# EAGLE design Pilot_Interface_005 (EAGLE 6.5.0)
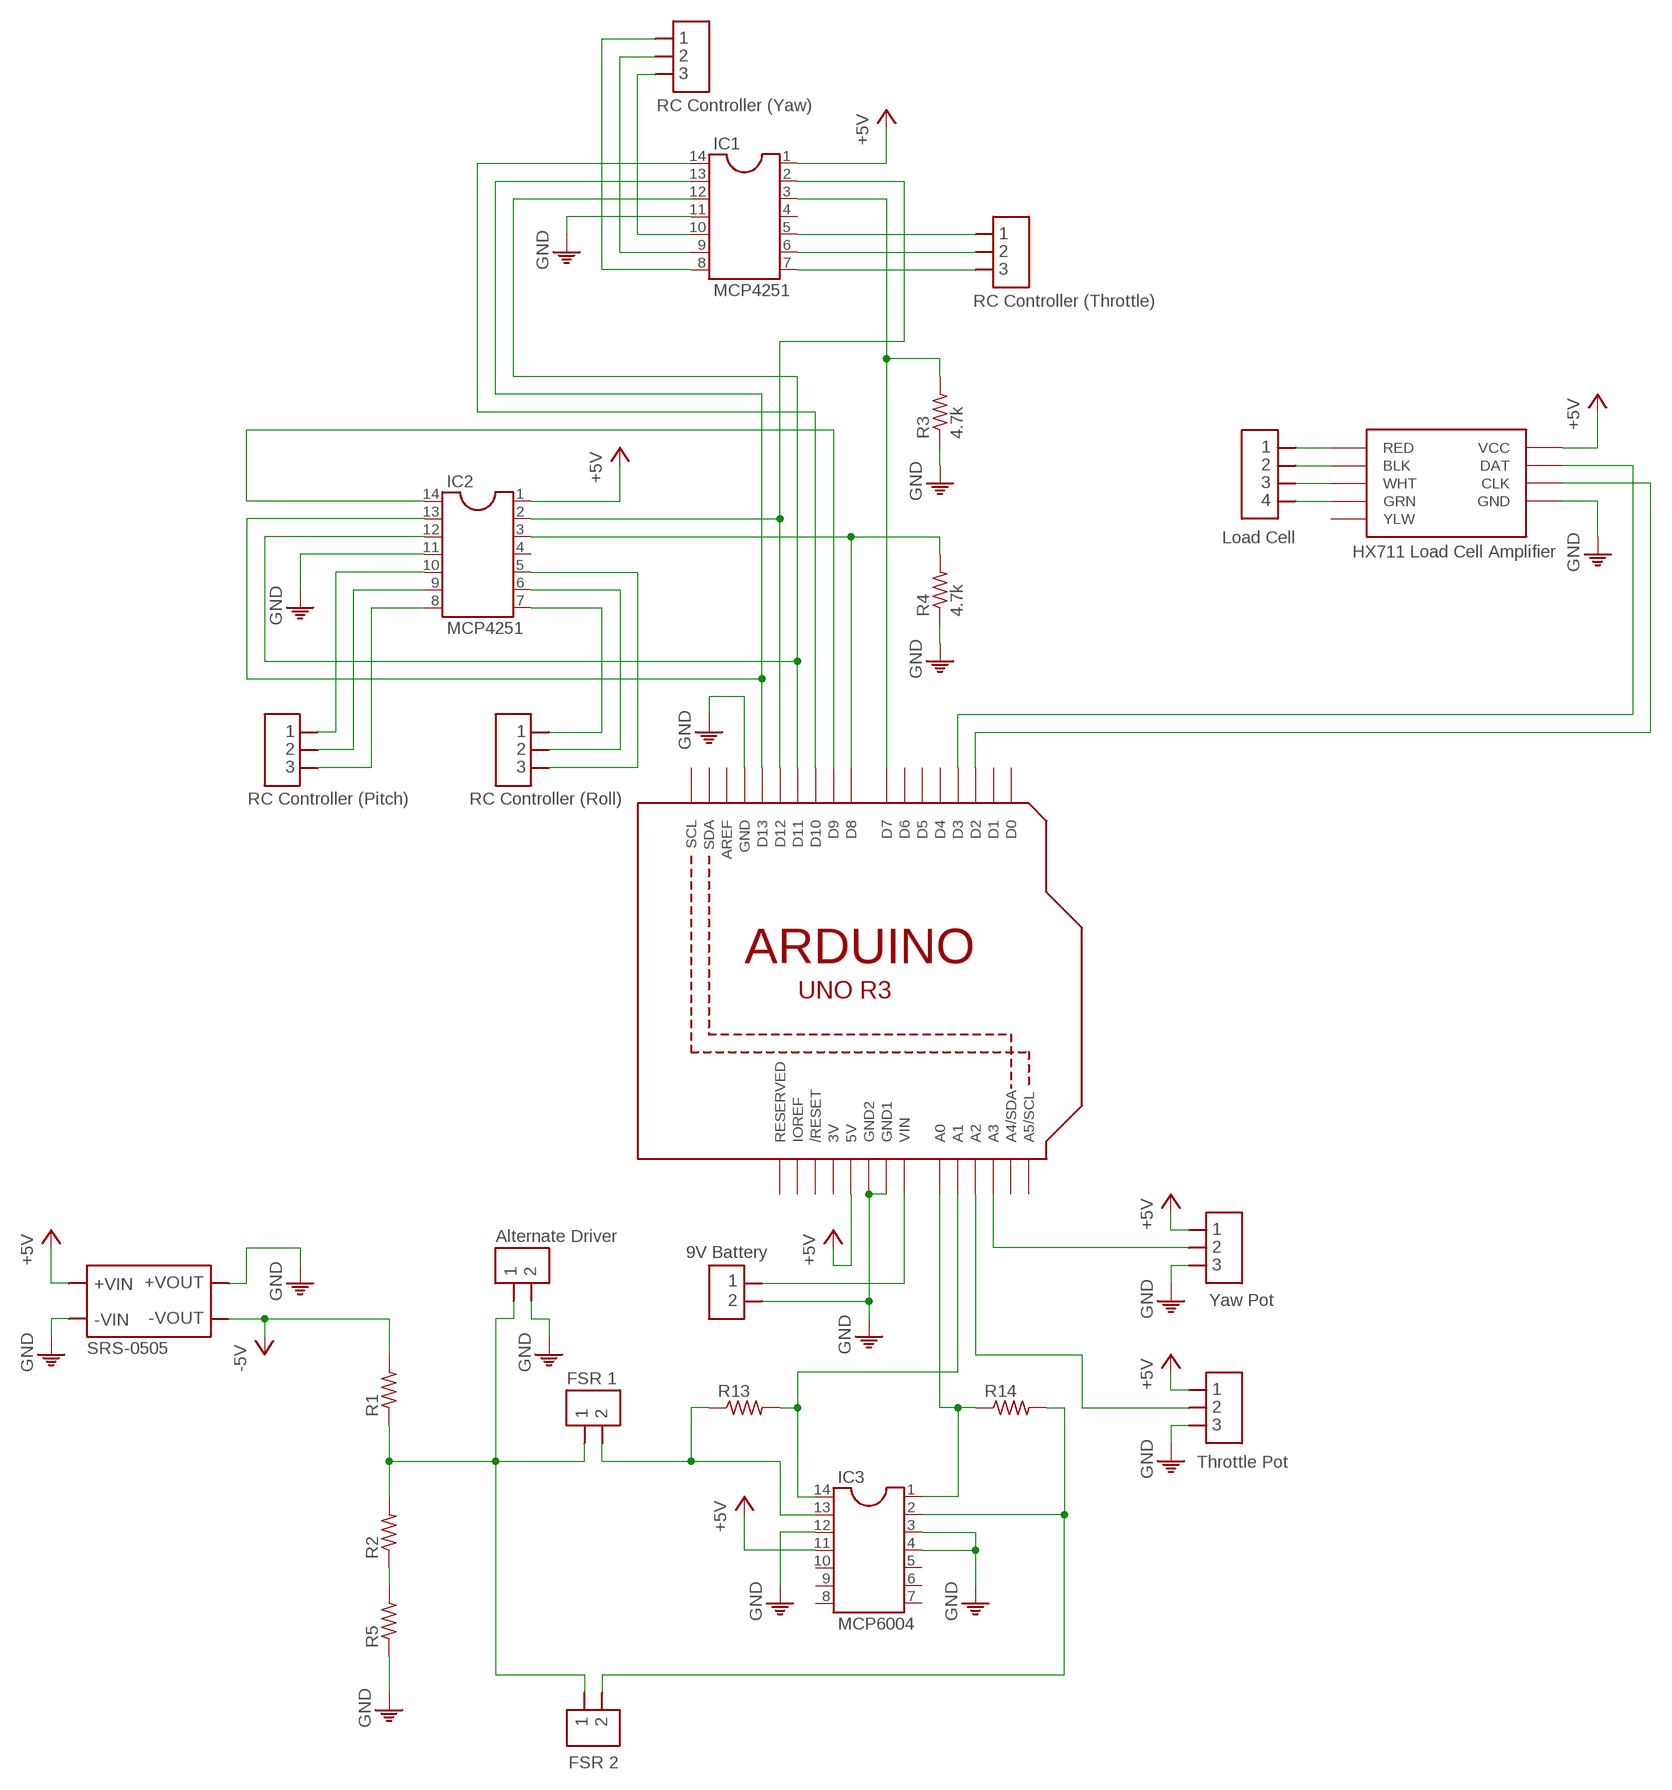
[diagram p0: schematic, sheet 1]

## Parts
IC1  MCP4251  DIL14  [DIL14]
IC2  MCP4251  DIL14  [DIL14]
IC3  MCP6004  DIL14  [DIL14]
R1  R-US_0204/2V  [0204V]
R2  R-US_0204/2V  [0204V]
R3  4.7k  R-US_0204/2V  [0204V]
R4  4.7k  R-US_0204/2V  [0204V]
R5  R-US_0204/2V  [0204V]
R13  R-US_0204/2V  [0204V]
R14  R-US_0204/2V  [0204V]
U1  ARDUINOR3  [ARDUINOR3]
U$1  HX711  [HX711]
U$2  PAD_3  [PAD_3]
U$3  PAD_3  [PAD_3]
U$4  PAD_2  [PAD_2]
U$5  PAD_2  [PAD_2]
U$6  PAD_3  [PAD_3]
U$7  PAD_3  [PAD_3]
U$8  PAD_4  [PAD_4]
U$9  SRS-0505  [SRS-0505]
U$10  PAD_3  [PAD_3]
U$11  PAD_3  [PAD_3]
U$12  PAD_2  [PAD_2]
U$13  PAD_2  [PAD_2]

## Nets
+5V: IC1.1 IC2.1 IC3.11 U1.5V U$1.VCC U$6.P$1 U$7.P$1 U$9.P$1(+VIN) U$9.P$16(+VIN)
-5V: R1.2 U$9.P$6(-VOUT) U$9.P$11(-VOUT)
N$1: U$1.RED U$8.P$1
N$2: U$1.BLK U$8.P$2
N$3: U$1.WHT U$8.P$3
N$4: U$1.GRN U$8.P$4
N$5: IC3.2 R14.2 U$5.P$2
N$6: U1.D2 U$1.CLK
N$7: U1.D3 U$1.DAT
N$8: IC3.14 R13.2 U1.A1
N$9: IC3.1 R14.1 U1.A0
N$10: U1.A3 U$6.P$2
N$11: U1.A2 U$7.P$2
N$12: R1.1 R2.2 U$4.P$1 U$5.P$1 U$12.P$1
N$13: IC2.14 U1.D9
N$14: IC1.14 U1.D10
N$15: IC1.13 IC2.13 U1.D13
N$16: IC1.12 IC2.12 U1.D11
N$17: IC1.2 IC2.2 U1.D12
N$18: IC1.3 R3.2 U1.D7
N$19: IC2.3 R4.2 U1.D8
N$20: IC1.5 U$3.P$1
N$21: IC1.6 U$3.P$2
N$22: IC1.7 U$3.P$3
N$23: IC1.10 U$2.P$3
N$24: IC1.9 U$2.P$2
N$25: IC1.8 U$2.P$1
N$26: IC2.8 U$10.P$3
N$27: IC2.9 U$10.P$2
N$28: IC2.10 U$10.P$1
N$29: IC2.7 U$11.P$1
N$30: IC2.6 U$11.P$2
N$31: IC2.5 U$11.P$3
N$32: IC3.13 R13.1 U$4.P$2
N$33: R2.1 R5.2
N$34: U1.VIN U$13.P$1
PE: IC1.11 IC2.11 IC3.3 IC3.4 IC3.12 R3.1 R4.1 R5.1 U1.GND U1.GND1 U1.GND2 U$1.GND U$6.P$3 U$7.P$3 U$9.P$7(+VOUT) U$9.P$8(-VIN) U$9.P$9(-VIN) U$9.P$10(+VOUT) U$12.P$2 U$13.P$2 ; supply symbol labelled GND
Unconnected: IC1.4 IC2.4 IC3.5 IC3.6 IC3.7 IC3.8 IC3.9 IC3.10 U1.A4(A4/SDA) U1.A5(A5/SCL) U1.AREF U1.D0 U1.D1 U1.D4 U1.D5 U1.D6 U1.IOREF U1.RESERVED U1.RESET(/RESET) U1.SCL U1.SDA U$1.YLW

## Notes on the sheet
- RC Controller (Yaw)
- RC Controller (Throttle)
- Load Cell
- RC Controller (Pitch) | RC Controller (Roll)
- Alternate Driver
- 9V Battery
- Yaw Pot
- FSR 1
- Throttle Pot
- FSR 2

## Power pins joined to a net without a drawn wire
3V: U1.3V

## Library data of the parts
IC1-IC3 = MTW:DIL14: Dual In Line / Socket
R1-R5 R13 R14 = adafruit:R-US_: RESISTOR, American symbol
U1 = MTW:ARDUINOR3: This is a new object for the new Arduino R3 - with extra pins that you may want to use (such as IOref, and duplicated A4/A5
U$1 = MTW:HX711
U$2 U$3 U$6 U$7 U$10 U$11 = MTW:PAD_3
U$4 U$5 U$12 U$13 = MTW:PAD_2
U$8 = MTW:PAD_4
U$9 = MTW:SRS-0505

## Board
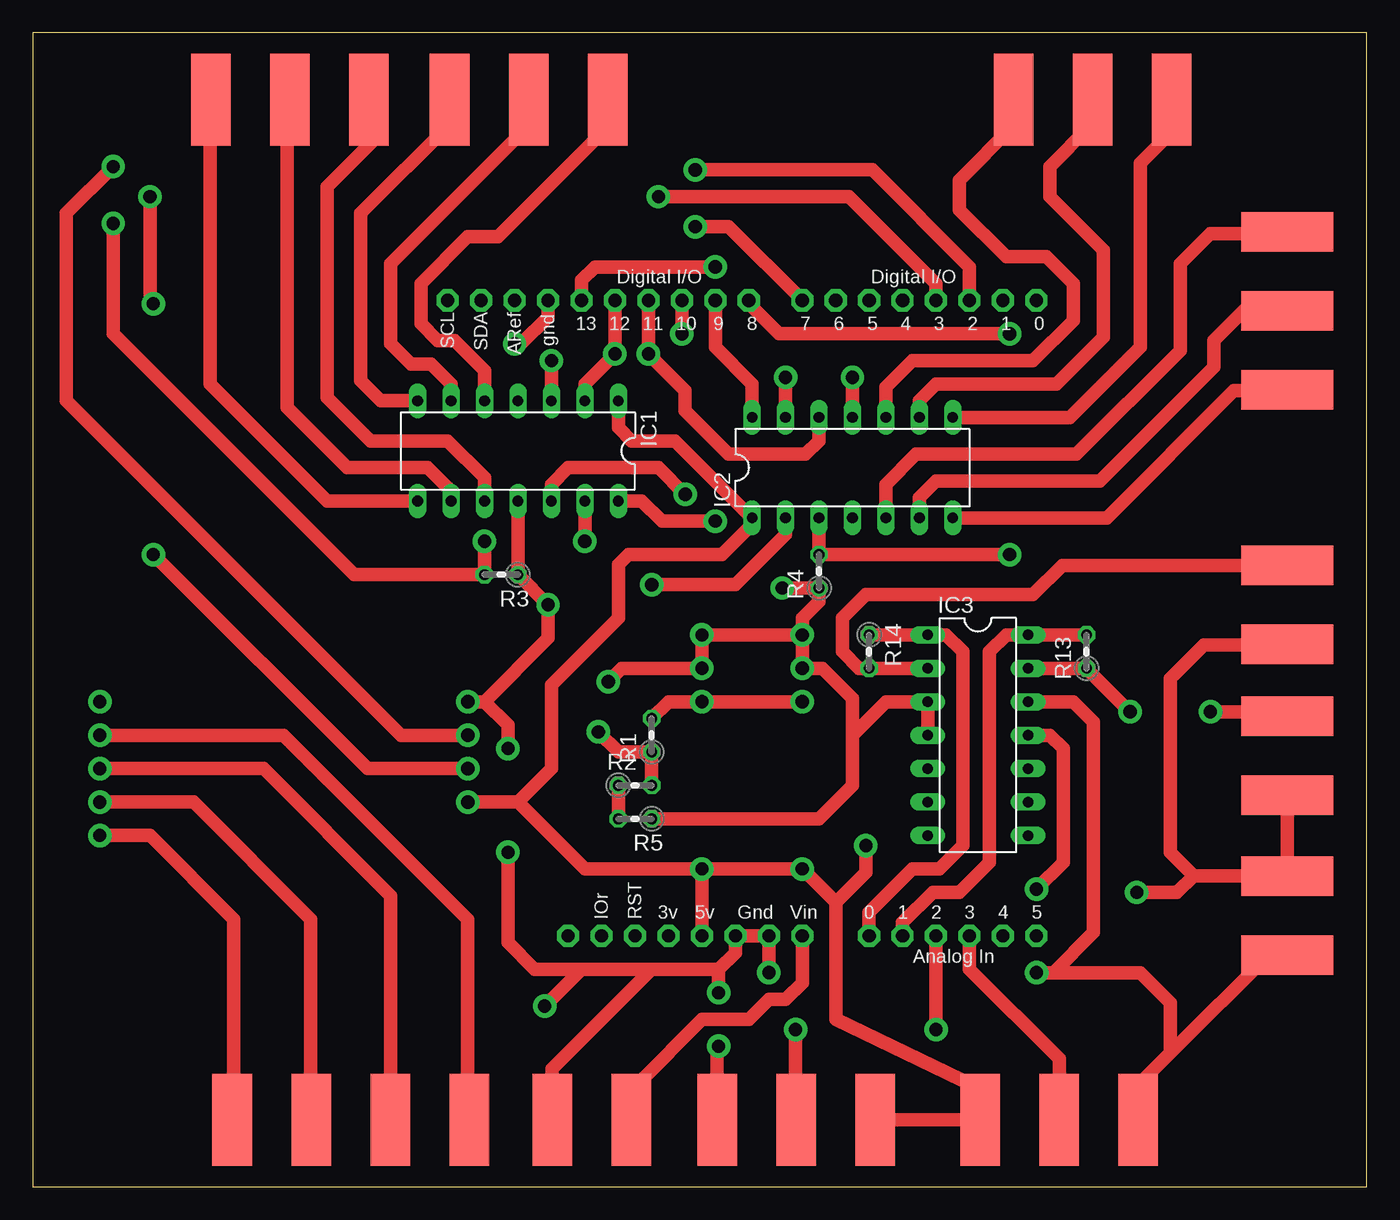
[diagram p1: board, top side]
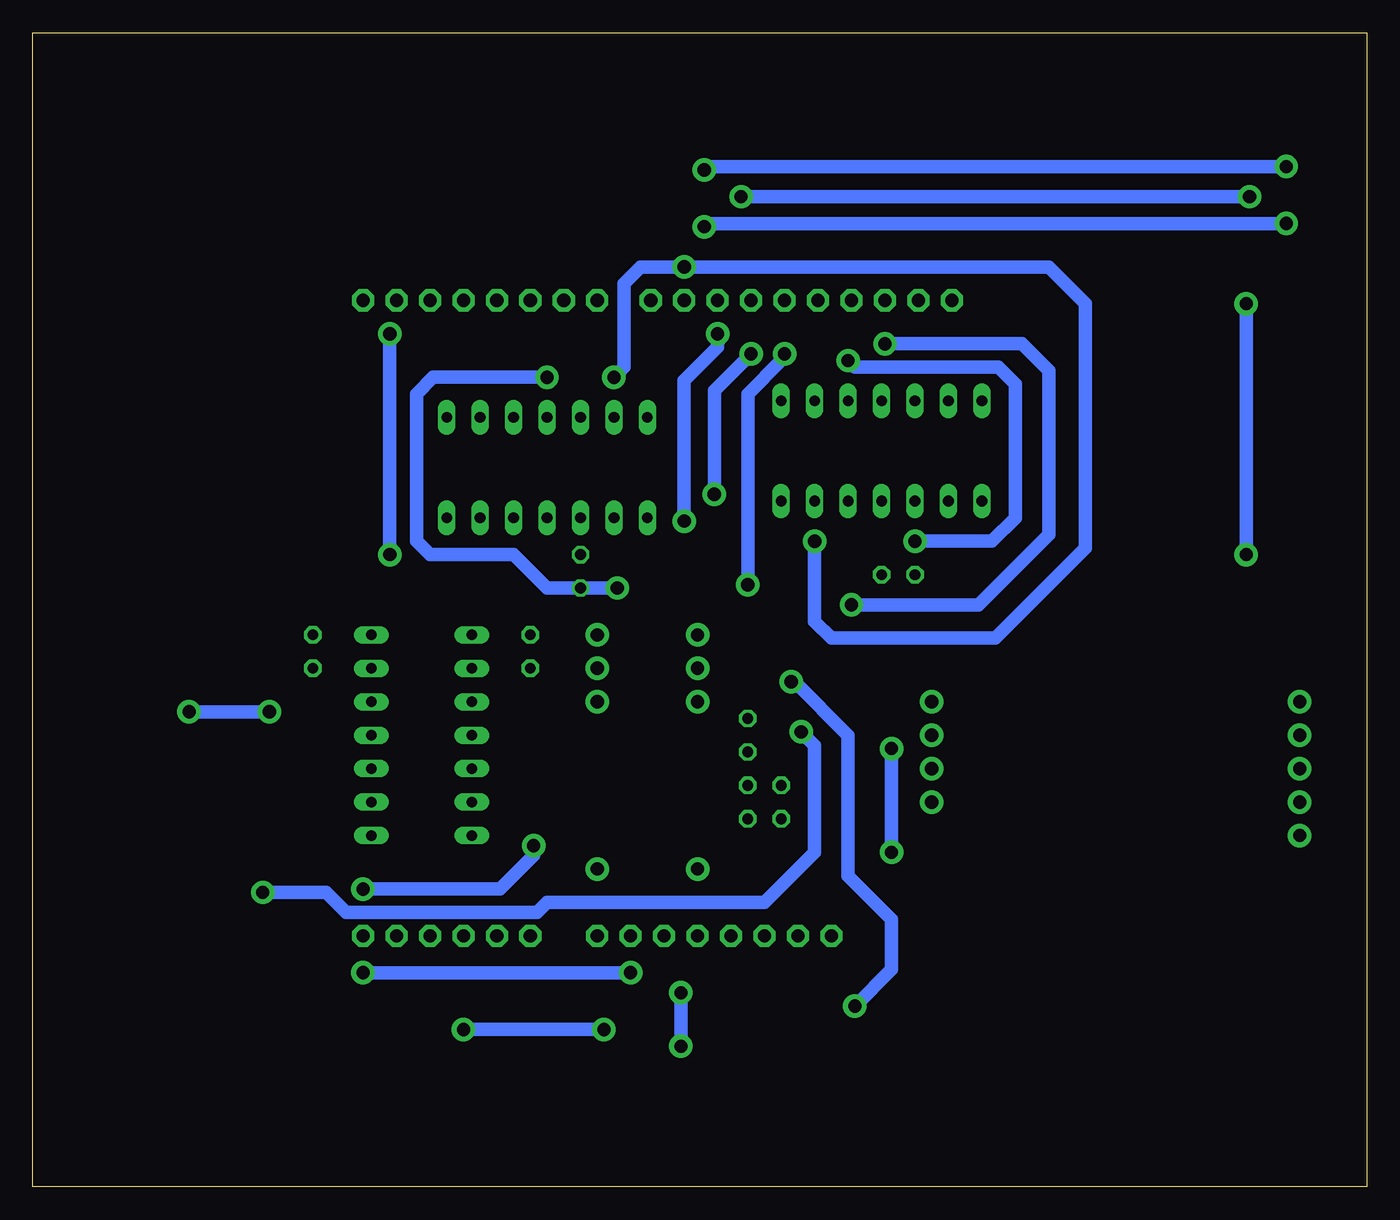
[diagram p2: board, bottom side, seen from below]

Size 101.27 x 87.62 mm. Coordinates in mm from the lower left corner, seen from the top.
Outline: 0,0 101.27,0 101.27,87.62 0,87.62 0,0
Copper layers (1*16): Top 0.035mm / dielectric 1.5mm / Bottom 0.035mm
Design rules "default": minimum track width 10mil, minimum drill 24mil, track to track 8mil, track to pad 8mil, pad to pad 8mil, via to via 8mil, smd to smd 8mil, copper to edge 40mil, drill to drill 8mil, minimum pad ring 10mil, minimum via ring 8mil, stop-mask expansion 4mil, vias tented up to drill 0mil, thermal gap 10mil

### Footprints (pad centres in the part's own frame; a part is rotated, then mirrored left to right if it is on the bottom)
DIL14 = drill 0.813 long: 1 -7.62,-3.81; 2 -5.08,-3.81; 3 -2.54,-3.81; 4 0,-3.81; 5 2.54,-3.81; 6 5.08,-3.81; 7 7.62,-3.81; 8 7.62,3.81; 9 5.08,3.81; 10 2.54,3.81; 11 0,3.81; 12 -2.54,3.81; 13 -5.08,3.81; 14 -7.62,3.81
0204V = drill 0.813 octagon: 1 -1.27,0; 2 1.27,0
ARDUINOR3 = drill 1 pad 1.676 octagon: 3V 35.56,2.54; 5V 38.1,2.54; A0 50.8,2.54; A1 53.34,2.54; A2 55.88,2.54; A3 58.42,2.54; A4 60.96,2.54; A5 63.5,2.54; AREF 23.876,50.8; D0 63.5,50.8; D1 60.96,50.8; D2 58.42,50.8; D3 55.88,50.8; D4 53.34,50.8; D5 50.8,50.8; D6 48.26,50.8; D7 45.72,50.8; D8 41.656,50.8; D9 39.116,50.8; D10 36.576,50.8; D11 34.036,50.8; D12 31.496,50.8; D13 28.956,50.8; GND 26.416,50.8; GND1 43.18,2.54; GND2 40.64,2.54; IOREF 30.48,2.54; RESERVED 27.94,2.54; RESET 33.02,2.54; SCL 18.796,50.8; SDA 21.336,50.8; VIN 45.72,2.54
HX711 = drill 1 pad 1.778: BLK 13.97,2.54; CLK -13.97,-2.54; DAT -13.97,0; GND -13.97,-5.08; GRN 13.97,-2.54; RED 13.97,5.08; VCC -13.97,2.54; WHT 13.97,0; YLW 13.97,-5.08
PAD_3 = smd 3 x 7: P$1 -3,0; P$2 3,0; P$3 9,0
PAD_2 = smd 3 x 7: P$1 -2,0; P$2 4,0
PAD_4 = smd 3 x 7: P$1 -9,0; P$2 -3,0; P$3 3,0; P$4 9,0
SRS-0505 = drill 1 pad 1.778: P$1 3.81,7.62; P$6 3.81,-5.08; P$7 3.81,-7.62; P$8 3.81,-10.16; P$9 -3.81,-10.16; P$10 -3.81,-7.62; P$11 -3.81,-5.08; P$16 -3.81,7.62

### Placement (x,y rotation side)
IC1  36.83,55.88 180 top
IC2  62.23,54.61 0 top
IC3  71.75,34.29 270 top
R1  46.99,34.29 90 top
R2  45.72,30.48 0 top
R3  35.56,46.48 180 top
R4  59.69,46.74 90 top
R5  45.72,27.94 180 top
R13  80.01,40.64 90 top
R14  63.5,40.64 270 top
U1  12.7,16.51 0 top
U$1  19.05,31.75 180 top
U$2  16.51,82.55 0 top
U$3  40.64,82.55 180 top
U$4  95.25,31.75 90 top
U$5  95.25,43.18 90 top
U$6  74.93,5.08 0 top
U$7  60.96,5.08 180 top
U$8  24.13,5.08 0 top
U$9  54.61,31.75 180 top
U$10  77.47,82.55 0 top
U$11  95.25,63.5 90 top
U$12  95.25,21.59 270 top
U$13  43.43,5.08 180 top

### Tracks (layer width: path | path; a pad name or v marks a point on that pad's centre or on a via)
+5V  (via drill 1 pad 1.78)
  Top 1.016: U1.5V U$9.P$1 | U$9.P$1 U$9.P$16 60.96,21.59 | U$1.VCC 36.83,29.21 | 36.83,29.21 41.91,24.13 U$9.P$1 | 36.83,29.21 39.37,31.75 39.37,38.1 44.45,43.18 44.45,47.24 45.21,48.01 52.32,48.01 54.61,50.29 IC2.1 48.77,56.64 45.47,56.64 44.45,57.66 IC1.1 | U$7.P$1 U$6.P$1 72.64,7.11 60.96,12.7 60.96,21.59 | IC3.11 77.22,34.29 78.23,33.27 78.23,24.64 v76.2,22.61 | v63.25,25.91 63.25,23.88 60.96,21.59
  Bottom 1.016: v63.25,25.91 63.25,25.15 65.79,22.61 v76.2,22.61
-5V
  Top 1.016: U$9.P$11 U$9.P$6 48.26,36.83 R1.2
N$1
  Top 0.406: U$8.P$1 15.24,5.08 15.24,8.89
  Top 1.016: U$1.RED 8.89,26.67 15.24,20.32 15.24,8.89 15.24,7.37
N$2
  Top 0.406: U$8.P$2 21.08,5.08 21.08,7.67
  Top 1.016: U$1.BLK 12.19,29.21 21.08,20.32 21.08,7.67
N$3
  Top 0.406: U$8.P$3 27.18,5.08 27.18,7.41
  Top 1.016: U$1.WHT 17.53,31.75 27.18,22.1 27.18,7.41
N$4
  Top 0.406: U$8.P$4 33.02,5.08 33.02,7.73
  Top 1.016: U$1.GRN 19.05,34.29 33.02,20.32 33.02,7.73
N$5
  Top 1.016: IC3.2 R14.2 62.74,39.37 61.47,40.64 61.47,43.18 63.25,44.96 75.95,44.96 78.17,47.18 U$5.P$2
N$6  (via drill 1 pad 1.78)
  Top 1.016: v50.29,77.22 63.75,77.22 71.12,69.85 U1.D2 | U$1.CLK 27.94,34.29 2.54,59.69 2.54,73.91 v6.1,77.47
  Bottom 1.016: v6.1,77.47 50.04,77.47 v50.29,77.22
N$7  (via drill 1 pad 1.78)
  Top 1.016: v47.5,75.18 61.98,75.18 68.58,68.58 U1.D3 | v8.89,75.18 8.89,67.31 v9.14,67.06 | v9.14,48.01 25.4,31.75 U$1.DAT
  Bottom 1.016: v8.89,75.18 v47.5,75.18 | v9.14,67.06 v9.14,48.01
N$8
  Top 1.016: R13.2 IC3.14 73.91,41.91 72.64,40.64 72.64,24.64 70.36,22.35 68.33,22.35 66.04,20.07 U1.A1
N$9
  Top 1.016: R14.1 IC3.1 69.34,41.91 70.61,40.64 70.61,25.91 68.83,24.13 66.8,24.13 63.5,20.83 U1.A0
N$10
  Top 1.016: U$6.P$2 77.93,9.7 71.12,16.51 U1.A3
N$11  (via drill 1 pad 1.78)
  Top 1.016: v57.91,11.94 57.91,8.08 U$7.P$2 | U1.A2 v68.58,11.94
  Bottom 1.016: v57.91,11.94 v68.58,11.94
N$12  (via drill 1 pad 1.78)
  Top 1.016: R2.2 R1.1 44.45,33.02 v42.93,34.54 | 95.22,23.62 U$12.P$1 95.25,24.13 | v83.82,22.35 86.87,22.35 88.14,23.62 | 95.25,24.13 94.74,23.62 88.14,23.62 | 88.14,23.62 86.36,25.4 86.36,38.61 88.9,41.15 95.22,41.15 U$5.P$1 | 95.25,24.13 U$4.P$1 95.25,30.48
  Bottom 1.016: v42.93,34.54 41.91,33.53 41.91,25.4 45.72,21.59 62.23,21.59 62.99,20.83 77.47,20.83 78.99,22.35 v83.82,22.35
N$13
  Top 1.016: U1.D9 51.82,63.75 54.61,60.96 IC2.14
N$14  (via drill 1 pad 1.78)
  Top 1.016: IC1.14 46.23,52.07 47.75,50.55 v51.82,50.55 52.07,50.8 | U1.D10 v49.28,64.77
  Bottom 1.016: v49.28,64.77 49.28,63.75 51.82,61.21 v51.82,50.55
N$15  (via drill 1 pad 1.78)
  Top 1.016: v51.82,69.85 42.67,69.85 41.66,68.83 U1.D13 | IC2.13 v57.15,61.47 | IC1.13 v41.91,49.02
  Bottom 1.016: v57.15,61.47 56.39,62.23 56.39,68.58 55.12,69.85 v51.82,69.85 24.13,69.85 21.34,67.06 21.34,48.51 28.19,41.66 40.64,41.66 41.91,42.93 v41.91,49.02
N$16  (via drill 1 pad 1.78)
  Top 1.016: U1.D11 v46.74,63.25 49.53,60.45 49.53,58.93 52.83,55.63 58.67,55.63 59.69,56.64 IC2.12 | v49.53,52.58 47.5,54.61 40.64,54.61 39.37,53.34 IC1.12
  Bottom 1.016: 47.06,63.17 arc45 46.88,63.25 v46.74,63.25 49.53,60.45 v49.53,52.58
N$17  (via drill 1 pad 1.78)
  Top 1.016: U1.D12 v44.2,63.25 41.91,60.96 IC1.2 | IC2.2 57.15,49.53 53.34,45.72 v46.99,45.72
  Bottom 1.016: 44.2,62.99 v44.2,63.25 44.45,62.99 44.45,62.74 46.99,60.2 v46.99,45.72
N$18  (via drill 1 pad 1.78)
  Top 1.016: v50.29,72.9 52.83,72.9 U1.D7 | v6.1,73.15 6.1,64.77 24.38,46.48 R3.2 v34.29,49.02 | IC1.3 v39.37,62.74
  Bottom 1.016: v6.1,73.15 50.04,73.15 v50.29,72.9 | v34.29,49.02 28.45,49.02 26.67,50.8 26.67,60.96 27.94,62.23 38.86,62.23 v39.37,62.74
N$19  (via drill 1 pad 1.78)
  Top 1.016: U1.D8 54.36,67.06 56.64,64.77 v74.17,64.77 | v74.17,48.01 R4.2 IC2.3
  Bottom 1.016: v74.17,64.77 v74.17,48.01
N$20
  Top 1.016: IC1.5 34.29,61.98 32,64.26 30.73,64.26 29.46,65.53 29.46,68.58 33.02,72.14 35.31,72.14 43.18,80.01 43.18,82.09 U$3.P$1
N$21
  Top 1.016: IC1.6 31.75,60.96 30.23,62.48 28.7,62.48 27.18,64.01 27.18,70.1 37.59,80.52 37.59,82.6 | 37.59,83.31 37.59,82.6 | 37.59,82.6 U$3.P$2
N$22
  Top 1.016: IC1.7 26.42,59.69 24.89,61.21 24.89,73.91 31.75,80.77 31.75,82.44 U$3.P$3
N$23
  Top 1.016: IC1.10 34.29,53.85 31.5,56.64 25.65,56.64 22.35,59.94 22.35,75.95 25.65,79.25 25.65,82.41 U$2.P$3
N$24
  Top 1.016: IC1.9 31.75,52.83 29.97,54.61 23.88,54.61 19.3,59.18 19.3,82.34 U$2.P$2
N$25
  Top 1.016: IC1.8 22.35,52.07 13.46,60.96 13.46,82.5 U$2.P$1
N$26
  Top 1.016: IC2.8 78.74,58.42 84.07,63.75 84.07,77.72 86.36,80.01 86.36,82.44 U$10.P$3
N$27
  Top 1.016: IC2.9 67.31,59.69 68.58,60.96 77.72,60.96 81.28,64.52 81.28,71.12 77.22,75.18 77.22,77.47 80.26,80.52 80.26,82.34 U$10.P$2
N$28
  Top 1.016: IC2.10 64.77,60.71 66.8,62.74 75.95,62.74 78.99,65.79 78.99,68.58 76.96,70.61 73.91,70.61 70.36,74.17 70.36,76.45 74.42,80.52 74.42,82.5 U$10.P$1
N$29
  Top 1.016: IC2.7 81.53,50.8 91.19,60.45 95.2,60.45 U$11.P$1
N$30
  Top 1.016: IC2.6 67.31,52.32 68.58,53.59 81.03,53.59 89.66,62.23 89.66,64.26 92.2,66.8 94.95,66.8 U$11.P$2
N$31
  Top 1.016: IC2.5 64.77,53.34 67.06,55.63 79.25,55.63 87.12,63.5 87.12,70.1 89.41,72.39 95.36,72.39 | 96.52,72.39 95.36,72.39 | 95.36,72.39 U$11.P$3
N$32  (via drill 1 pad 1.78)
  Top 1.016: IC3.13 R13.1 v83.31,36.07 | v89.41,36.07 94.93,36.07 U$4.P$2
  Bottom 1.016: v83.31,36.07 v89.41,36.07
N$33
  Top 1.016: R2.1 R5.2
N$34
  Top 1.016: U1.VIN 58.42,15.49 57.15,14.22 55.88,14.22 54.36,12.7 50.8,12.7 45.97,7.87 45.97,5.62 U$13.P$1
PE  (via drill 1 pad 1.78)
  Top 1.016: U$9.P$8 U$9.P$9 | U$9.P$8 U$9.P$7 44.7,39.37 v43.69,38.35 | U$9.P$9 U$9.P$10 59.94,39.37 62.23,37.08 62.23,34.29 | U$1.GND 34.29,36.83 | 34.29,36.83 36.07,35.05 v36.07,33.27 | 34.29,36.83 39.12,41.66 v39.12,44.2 R3.1 IC1.11 | v36.07,25.4 36.07,18.54 38.1,16.51 41.66,16.51 | 52.07,16.51 53.34,17.78 U1.GND2 U1.GND1 v55.88,16.26 | U$9.P$8 52.07,41.91 | 62.23,34.29 64.77,36.83 IC3.3 IC3.4 | 52.07,16.51 46.99,16.51 | 46.99,16.51 41.66,16.51 | 41.66,16.51 v38.86,13.72 | R5.1 59.69,27.94 62.23,30.48 62.23,34.29 | 86.36,10.16 83.93,7.73 U$6.P$3 84.58,8.27 | 86.36,10.16 93.98,17.78 95.06,17.78 U$12.P$2 | v76.2,16.26 77.47,16.26 | 77.47,16.26 80.52,19.3 80.52,35.31 78.99,36.83 IC3.12 | 77.47,16.26 84.07,16.26 86.36,13.97 86.36,10.16 | U$13.P$2 39.43,8.95 46.99,16.51 | U$7.P$3 51.96,10.56 v52.07,10.67 | v52.07,14.73 52.07,16.51 | U$9.P$9 58.42,43.18 59.69,44.45 R4.1 v56.9,45.47 | v36.58,64.01 37.08,64.01 39.12,66.04 U1.GND | IC2.11 v62.23,61.47
  Bottom 1.016: v39.12,44.2 29.46,44.2 24.13,49.53 24.13,61.98 26.16,64.01 v36.58,64.01 | v36.07,33.27 v36.07,25.4 | v43.69,38.35 43.43,38.35 39.37,34.29 39.37,23.62 36.07,20.32 36.07,16.51 v38.86,13.72 | v76.2,16.26 v55.88,16.26 | v52.07,14.73 v52.07,10.67 | v62.23,61.47 70.87,61.47 72.14,60.2 72.14,49.02 71.12,48.01 64.77,48.01 62.23,45.47 v56.9,45.47